# EAGLE design LearnToSolder (EAGLE 7.6.0)
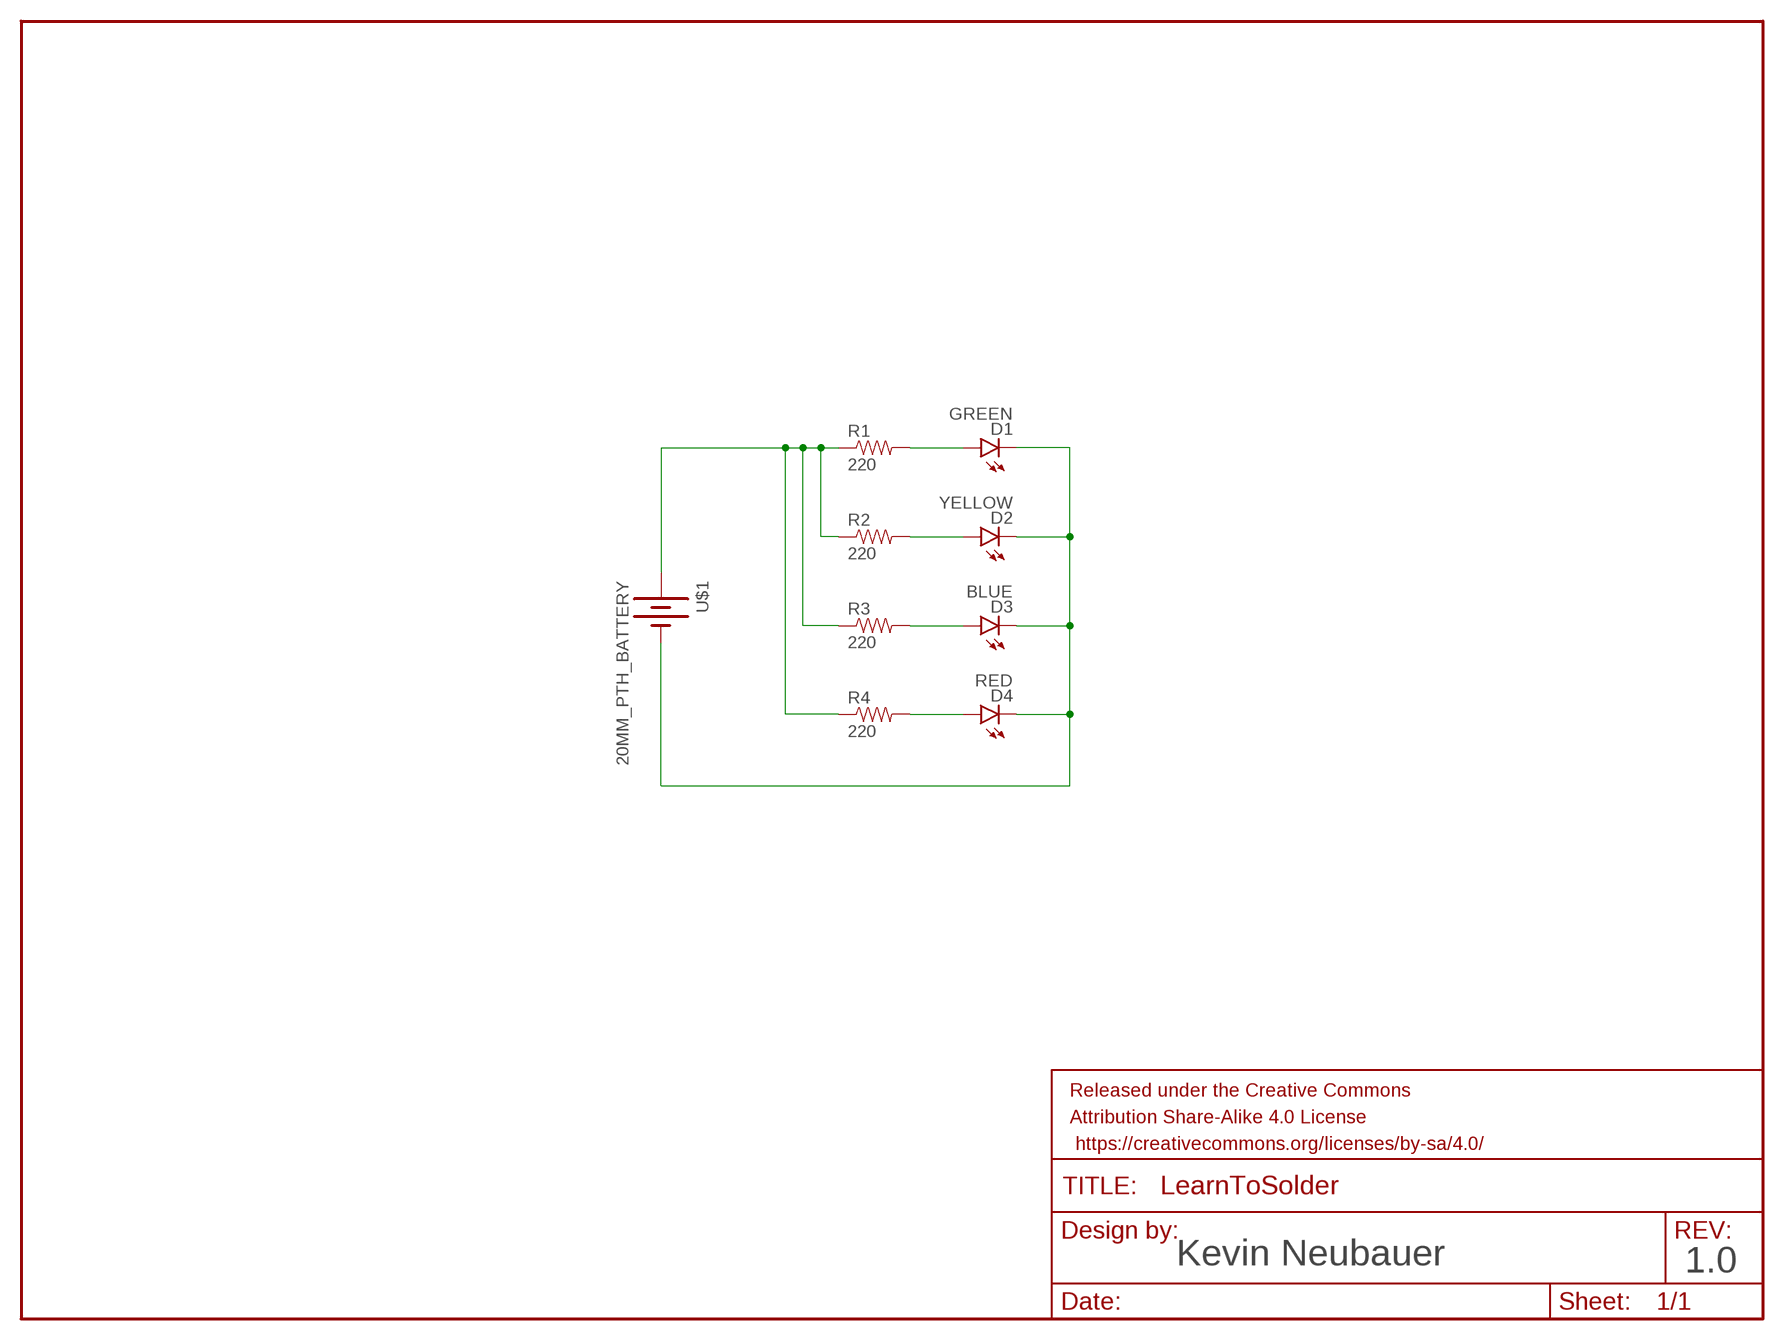
[diagram p0: schematic, sheet 1]

## Parts
D1  GREEN  LED5MM  [LED5MM]
D2  YELLOW  LED5MM  [LED5MM]
D3  BLUE  LED5MM  [LED5MM]
D4  RED  LED5MM  [LED5MM]
FRAME1  FRAME-LETTER  [CREATIVE_COMMONS]
R1  220  RESISTORPTH-1/4W  [AXIAL-0.4]
R2  220  RESISTORPTH-1/4W  [AXIAL-0.4]
R3  220  RESISTORPTH-1/4W  [AXIAL-0.4]
R4  220  RESISTORPTH-1/4W  [AXIAL-0.4]
U$1  20MM_PTH_BATTERY  [20MM_PTH_CR2032]

## Nets
3V3: R1.P$1 R2.P$1 R3.P$1 R4.P$1 U$1.1(+) U$1.3(+)
GND: D1.K(C) D2.K(C) D3.K(C) D4.K(C) U$1.2(-)
N$2: D1.A R1.P$2
N$3: D2.A R2.P$2
N$4: D3.A R3.P$2
N$5: D4.A R4.P$2

## Notes on the sheet
- Kevin Neubauer | 1.0

## Library data of the parts
D1-D4 = SparkFun-LED:LED: LEDs Standard schematic elements and footprints for 5mm, 3mm, 1206, and 0603 sized LEDs. 5mm - Spark Fun Electronics SKU : COM-00529 (and others)
FRAME1 = SparkFun-Aesthetics:FRAME-LETTER: Schematic Frame Standard 8.5x11 US Letter frame
R1-R4 = SparkFun-Resistors:RESISTOR: Resistor Basic schematic elements and footprints for 0603, 1206, and PTH resistors.
U$1 = Kevin-Electromechanical:20MM_PTH_BATTERY

## Board
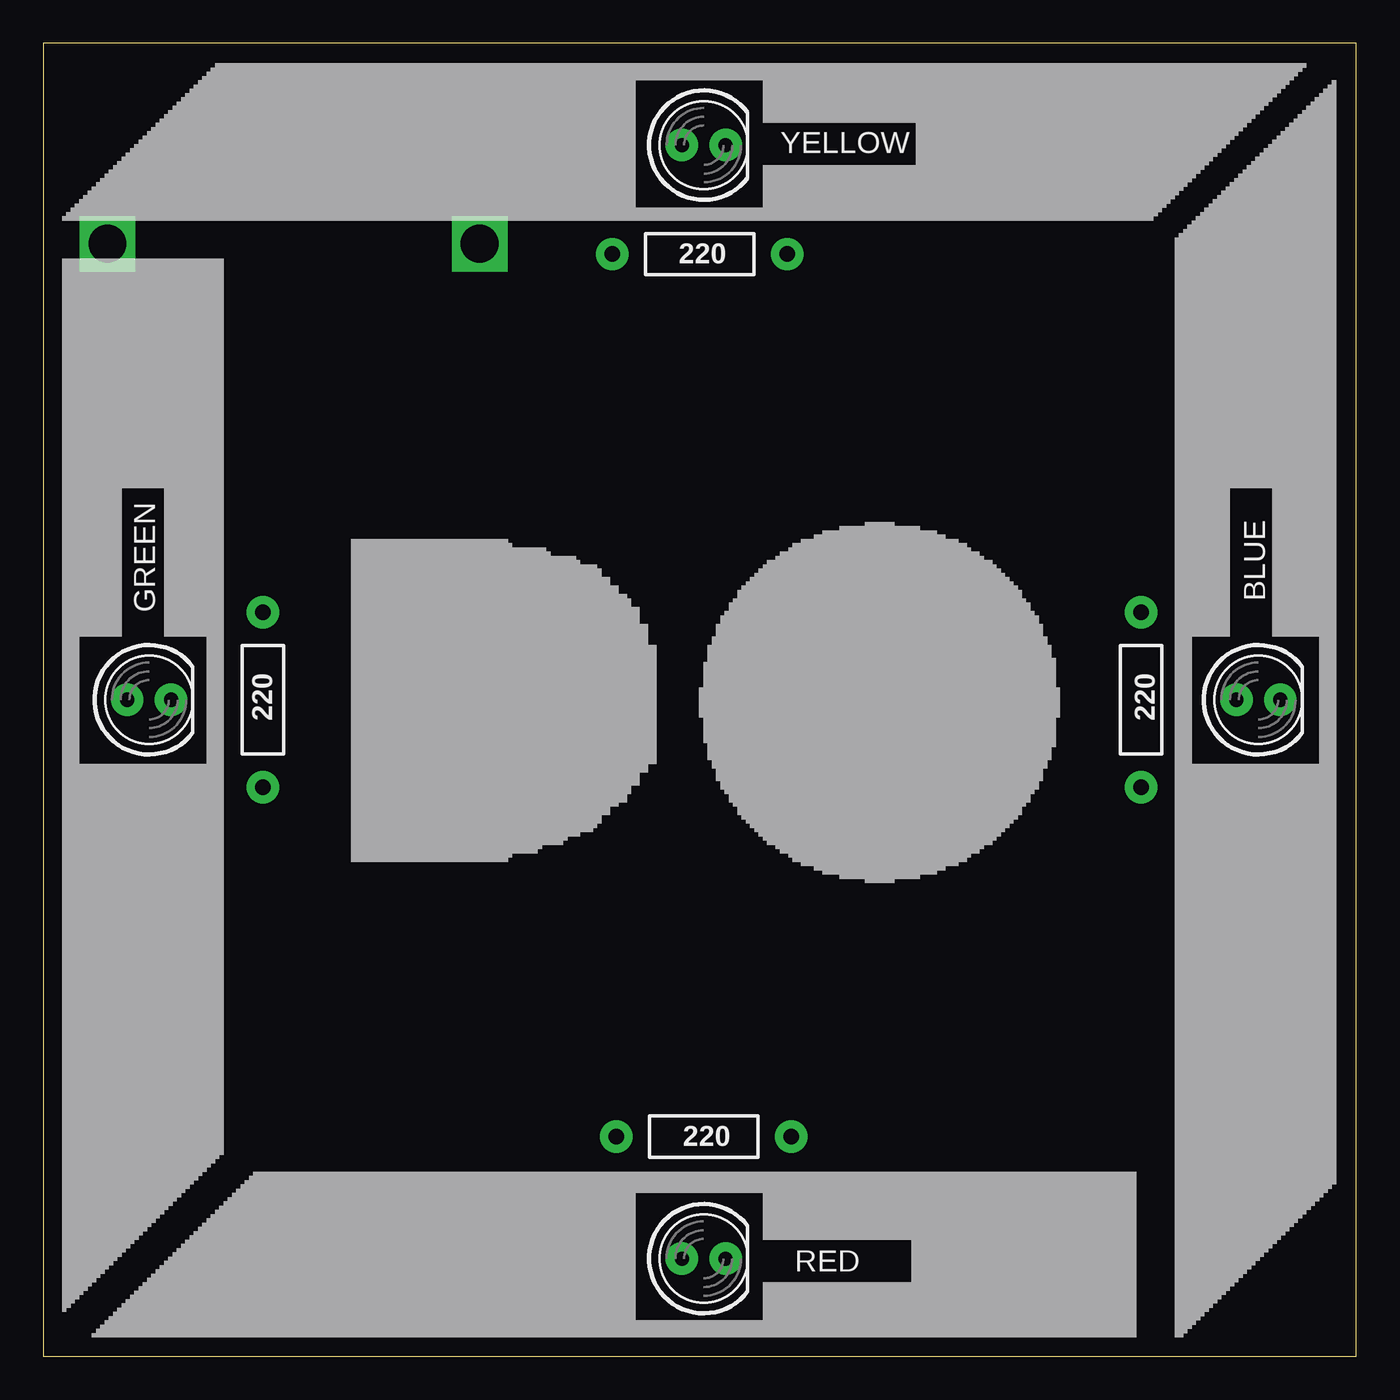
[diagram p1: board, top side]
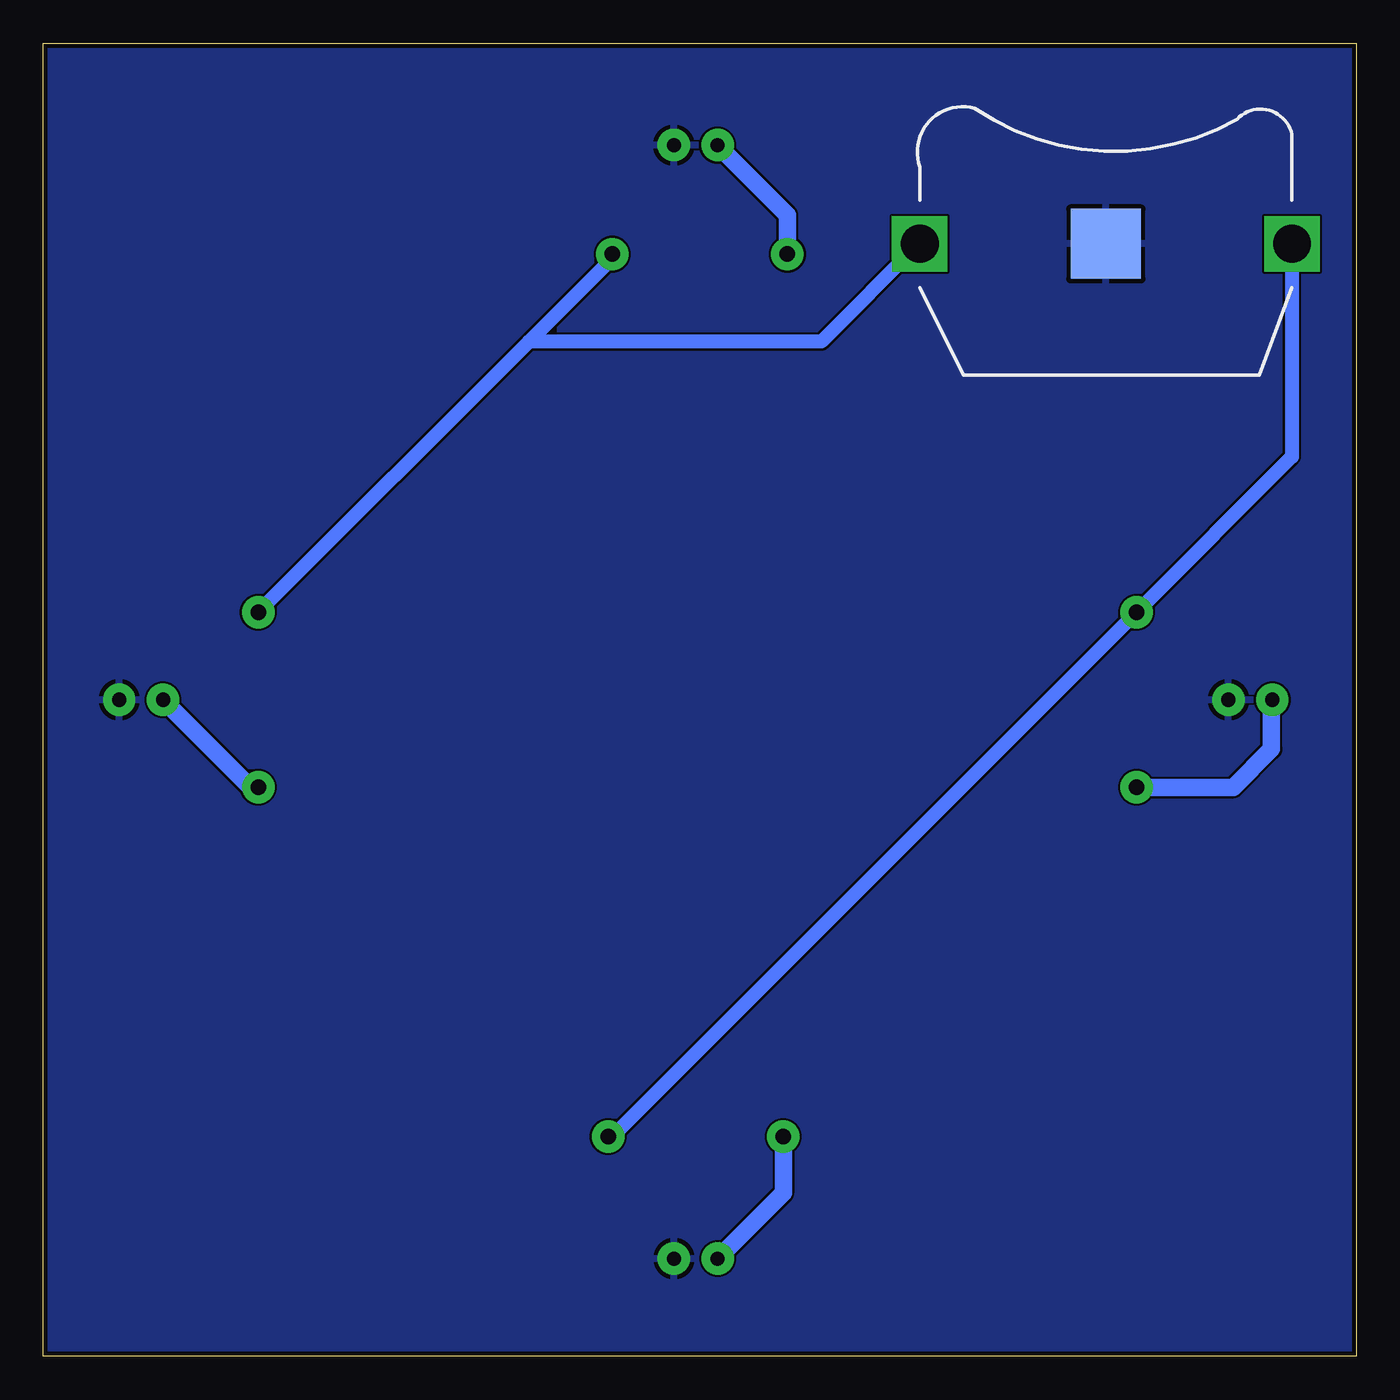
[diagram p2: board, bottom side, seen from below]

Size 76.2 x 76.2 mm. Coordinates in mm from the lower left corner, seen from the top.
Outline: 0,0 76.2,0 76.2,76.2 0,76.2 0,0
Copper layers (1*16): Top 0.035mm / dielectric 1.5mm / Bottom 0.035mm
Design rules "dirt_cheap_dirty_boards.v1": minimum track width 5mil, minimum drill 12mil, track to track 5mil, track to pad 5mil, pad to pad 5mil, via to via 5mil, smd to smd 0mil, copper to edge 10mil, drill to drill 10mil, minimum pad ring 10mil, minimum via ring 6mil, stop-mask expansion 2mil, vias tented up to drill 25mil, thermal gap 10mil

### Footprints (pad centres in the part's own frame; a part is rotated, then mirrored left to right if it is on the bottom)
LED5MM = drill 0.813 pad 1.88: A -1.27,0; K 1.27,0
AXIAL-0.4 = drill 0.9 pad 1.88: P$1 -5.08,0; P$2 5.08,0
20MM_PTH_CR2032 = drill 2.2 square: 1 -10.8,0; 3 10.8,0 | smd 4.064 x 4.064: 2 0,0

### Placement (x,y rotation side)
D1  6.15,38.1 0 top
D2  38.34,70.28 0 top
D3  70.52,38.1 0 top
D4  38.33,5.67 0 top
FRAME1  7.84,-8.1 0 top  (outside the outline)
R1  12.75,38.1 270 top
R2  38.09,63.95 180 top
R3  63.72,38.1 270 top
R4  38.34,12.75 180 top
U$1  14.54,64.55 0 bottom

### Tracks (layer width: path | path; a pad name or v marks a point on that pad's centre or on a via)
3V3
  Bottom 0.813: U$1.1 25.38,64.55 31.04,58.88 48.01,58.88 | 48.01,58.88 R3.P$1 | R2.P$1 43.17,63.72 48.01,58.88 | U$1.3 3.74,52.2 R1.P$1 43.19,12.75 R4.P$1
GND
  pour Bottom: 0,0 76.4,0 76.4,76 0,76
N$2
  Bottom 1.016: R1.P$2 7.14,33.02 4.93,35.23 4.93,38.05 D1.A
N$3
  Bottom 1.016: R2.P$2 33.02,66.23 D2.A
N$4
  Bottom 1.016: R3.P$2 64.17,33.02 D3.A
N$5
  Bottom 1.016: R4.P$2 33.26,9.48 D4.A

### Text on the board
tDocu: Kevin Neubauer